# EAGLE schematic CALalarm-r1 (EAGLE 9.6.2)
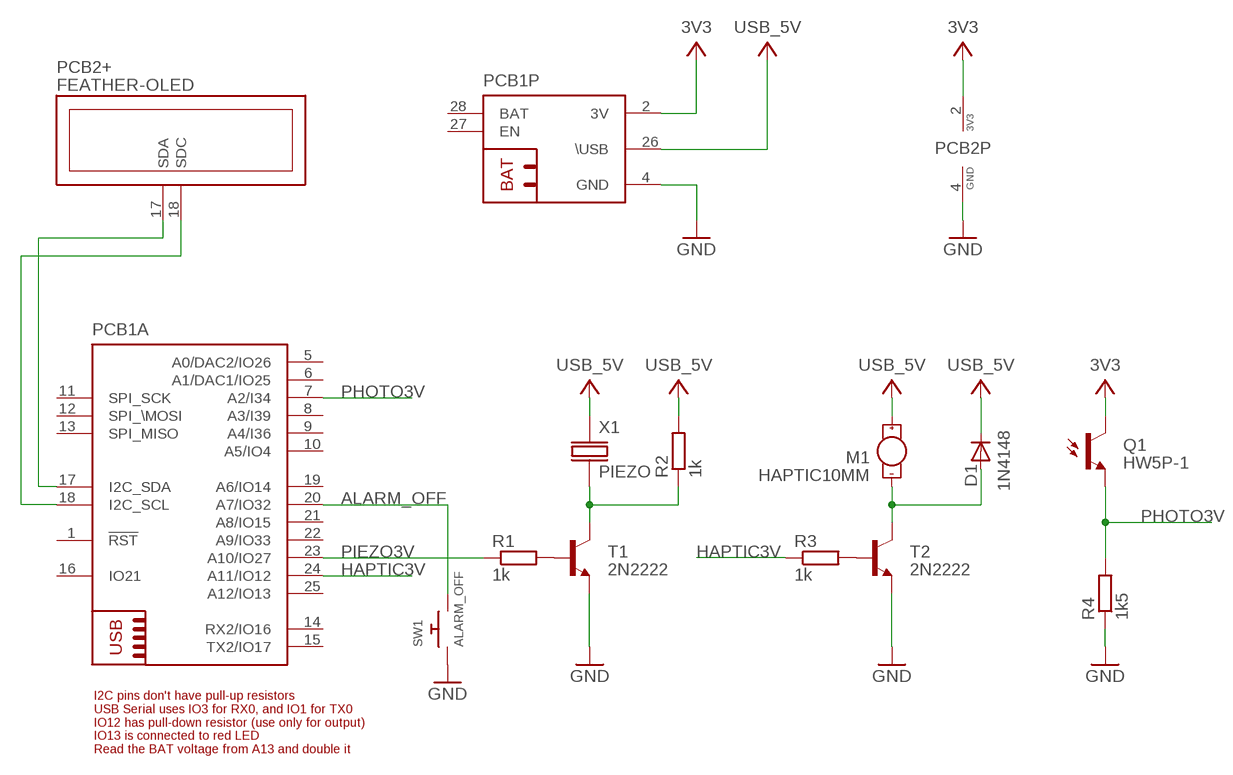
[diagram p0: schematic, sheet 1]

## Parts
D1  1N4148  1N4148DO35-10  [DO35-10]
M1  HAPTIC10MM  [VIBE-MOTOR-10MM]
PCB1  FEATHER-ESP32  [FEATHER-ESP32]
PCB2  FEATHER-OLED  [FEATHER-OLED]
Q1  HW5P-1  PHOTOTRANSISTORPT17-21C-L41-TR8  [PT17-21C-L41-TR8]
R1  1k  R-EU_0411/15  [0411/15]
R2  1k  R-EU_0411/15  [0411/15]
R3  1k  R-EU_0411/15  [0411/15]
R4  1k5  R-EU_0411/15  [0411/15]
SW1  ALARM_OFF  SWITCH_PUSHBUTTONSOFTTOUCHSMD_SJ  [PUSHBUTTON_SMD_SJ]
T1  2N2222  [TO92-EBC-OVAL]
T2  2N2222  [TO92-EBC-OVAL]
X1  PIEZO  [0402-CAP]

## Nets
3V: PCB1.2(P:3V) ; supply symbol labelled 3V3
+3V3: PCB2.2(P:VCC) Q1.C ; supply symbol labelled 3V3
+5V: D1.C M1.+ R2.2 X1.1 ; supply symbol labelled USB_5V
\USB: PCB1.26(P:\USB) ; supply symbol labelled USB_5V
ALARM_OFF: PCB1.20(A:A7/IO32) SW1.P$2
GND: PCB1.4(P:GND) PCB2.4(P:GND) R4.1 SW1.P$1 T1.E T2.E
HAPTIC3V: PCB1.24(A:A11/IO12) R3.1
N$1: R2.1 T1.C X1.2
N$2: R1.2 T1.B
N$3: PCB1.17(A:I2C_SDA) PCB2.17(+:SDA)
N$4: D1.A M1.- T2.C
N$5: R3.2 T2.B
N$6: PCB1.18(A:I2C_SCL) PCB2.18(+:SDC)
PHOTO3V: PCB1.7(A:A2/I34) Q1.E R4.2
PIEZO3V: PCB1.23(A:A10/IO27) R1.1
Unconnected: PCB1.1(A:!RST) PCB1.5(A:A0/DAC2/IO26) PCB1.6(A:A1/DAC1/IO25) PCB1.8(A:A3/I39) PCB1.9(A:A4/I36) PCB1.10(A:A5/IO4) PCB1.11(A:SPI_SCK) PCB1.12(A:SPI_\MOSI) PCB1.13(A:SPI_MISO) PCB1.14(A:RX2/IO16) PCB1.15(A:TX2/IO17) PCB1.16(A:IO21) PCB1.19(A:A6/IO14) PCB1.21(A:A8/IO15) PCB1.22(A:A9/IO33) PCB1.25(A:A12/IO13) PCB1.27(P:EN) PCB1.28(P:BAT) PCB2.1 PCB2.19 PCB2.20 PCB2.21

## Library data of the parts
D1 = diode:1N4148: DIODE high speed (Philips)
M1 = Coert Vonk:HAPTIC: Vibration Motor- ROB-08449 Physical dimension and wire connections for this powerful vibration motor. Motor has a self adhesive backing.
PCB1 = CALalarm:FEATHER-ESP32: Adafruit HUZZAH ESP32 Feather
PCB2 = Coert Vonk:FEATHER-OLED: Package buttons position and size approximate
Q1 = SparkFun-DiscreteSemi:PHOTOTRANSISTOR; PROD_ID: TRANS-12141
R1-R4 = resistor:R-EU_: RESISTOR, European symbol
SW1 = Coert Vonk:SWITCH_PUSHBUTTON: Buttons SOFTTOUCHSMD_SJ - Soft touch temporary push button (Super Junk Akihabara) Compatible with SKPMANE010 [Mouser: 688-SKPMAN] C&K_KSS = Digikey: KSS221GLFS
T1 T2 = adafruit:2N2222: NPN TRANSISTOR Big oval pads
X1 = Coert Vonk:PIEZO: Dummy package